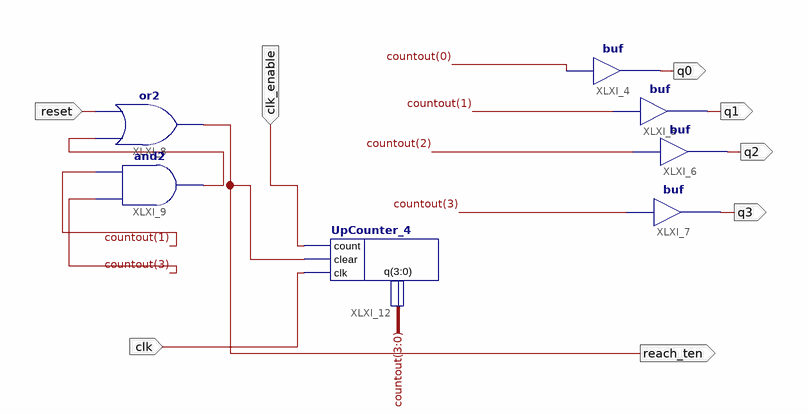
[diagram p0: schematic sheet 1]
// Xilinx ISE schematic Mod_10_Upcount.sch (spartan3e) as structural Verilog: 7 symbols, 8 ports
module Mod_10_Upcount (
  input  clk_enable,
  input  clk,
  input  reset,
  output q0,
  output q1,
  output q2,
  output q3,
  output reach_ten
);

  wire XLXN_21;
  wire [3:0] countout;

  buf XLXI_4 (q0, countout[0]);
  buf XLXI_5 (q1, countout[1]);
  buf XLXI_6 (q2, countout[2]);
  buf XLXI_7 (q3, countout[3]);
  or XLXI_8 (reach_ten, XLXN_21, reset);
  and XLXI_9 (XLXN_21, countout[3], countout[1]);
  UpCounter_4 XLXI_12 (.clk(clk), .q(countout), .clear(reach_ten), .count(clk_enable));
endmodule
